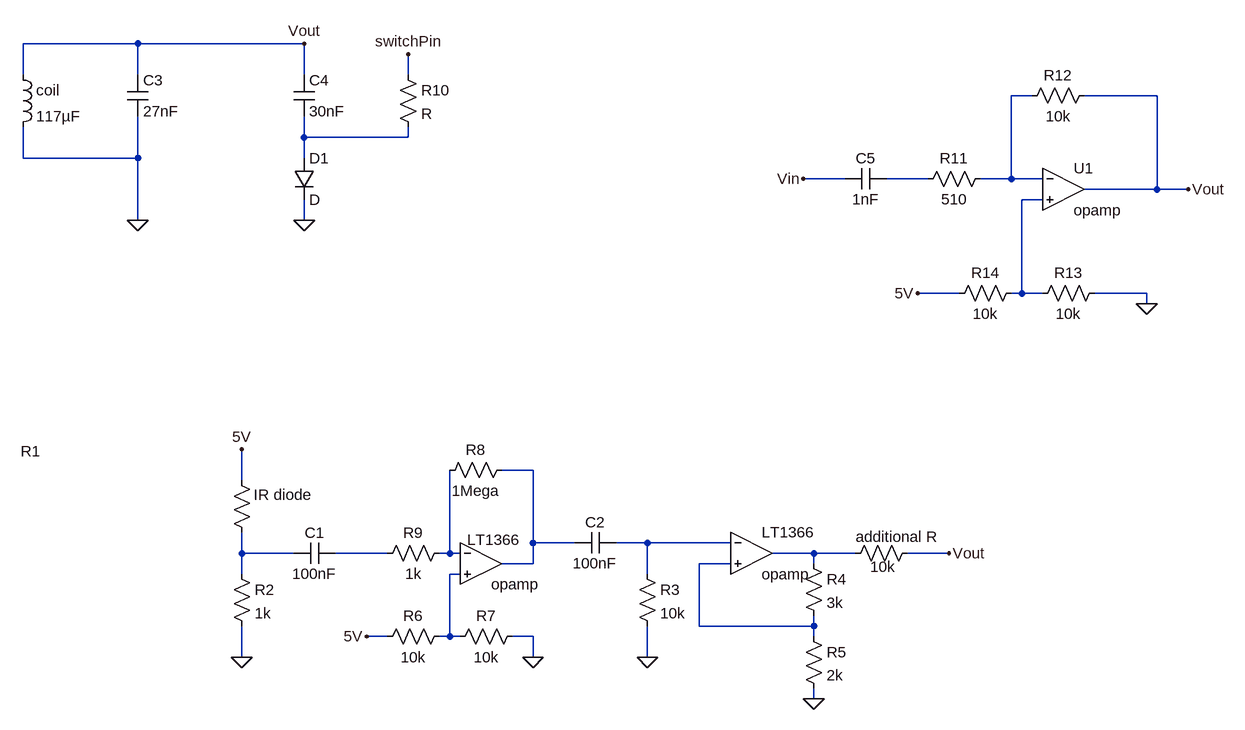
[diagram p0: schematic IR sensor circuit.asc]
IR sensor circuit.asc, the LTspice schematic file:
Version 4
SHEET 1 1496 680
WIRE -192 -624 -368 -624
WIRE 64 -624 -192 -624
WIRE -368 -576 -368 -624
WIRE -192 -576 -192 -624
WIRE 64 -576 64 -624
WIRE 224 -576 224 -608
WIRE 1184 -544 1152 -544
WIRE 1376 -544 1264 -544
WIRE 64 -480 64 -512
WIRE 224 -480 224 -496
WIRE 224 -480 64 -480
WIRE -368 -448 -368 -496
WIRE -192 -448 -192 -512
WIRE -192 -448 -368 -448
WIRE 64 -448 64 -480
WIRE 896 -416 832 -416
WIRE 1024 -416 960 -416
WIRE 1152 -416 1152 -544
WIRE 1152 -416 1104 -416
WIRE 1200 -416 1152 -416
WIRE 1376 -400 1376 -544
WIRE 1376 -400 1264 -400
WIRE 1424 -400 1376 -400
WIRE 1200 -384 1168 -384
WIRE -192 -352 -192 -448
WIRE 64 -352 64 -384
WIRE 1072 -240 1008 -240
WIRE 1168 -240 1168 -384
WIRE 1168 -240 1152 -240
WIRE 1200 -240 1168 -240
WIRE 1360 -240 1280 -240
WIRE 1360 -224 1360 -240
WIRE 416 32 368 32
WIRE -32 48 -32 0
WIRE 416 144 416 32
WIRE 480 144 416 144
WIRE 592 144 544 144
WIRE 720 144 592 144
WIRE -32 160 -32 128
WIRE 48 160 -32 160
WIRE 192 160 112 160
WIRE 288 160 288 32
WIRE 288 160 272 160
WIRE 304 160 288 160
WIRE 848 160 784 160
WIRE 912 160 848 160
WIRE 1056 160 992 160
WIRE 416 176 416 144
WIRE 416 176 368 176
WIRE 720 176 672 176
WIRE 848 176 848 160
WIRE -32 192 -32 160
WIRE 304 192 288 192
WIRE 592 192 592 144
WIRE 672 272 672 176
WIRE 848 272 848 256
WIRE 848 272 672 272
WIRE 192 288 160 288
WIRE 288 288 288 192
WIRE 288 288 272 288
WIRE 304 288 288 288
WIRE 416 288 384 288
WIRE 848 288 848 272
WIRE -32 320 -32 272
WIRE 416 320 416 288
WIRE 592 320 592 272
WIRE 848 384 848 368
FLAG -32 0 5V
FLAG 160 288 5V
FLAG -32 320 0
FLAG 416 320 0
FLAG 592 320 0
FLAG 848 384 0
FLAG 1056 160 Vout
FLAG -192 -352 0
FLAG 64 -352 0
FLAG 224 -608 switchPin
FLAG 64 -624 Vout
FLAG 1360 -224 0
FLAG 832 -416 Vin
FLAG 1424 -400 Vout
FLAG 1008 -240 5V
SYMBOL res -48 32 R0
WINDOW 0 -324 -29 Left 2
WINDOW 3 34 38 Left 2
SYMATTR InstName R1
SYMATTR Value IR diode
SYMBOL res -48 176 R0
SYMATTR InstName R2
SYMATTR Value 1k
SYMBOL cap 544 128 R90
WINDOW 0 0 32 VBottom 2
WINDOW 3 32 32 VTop 2
SYMATTR InstName C2
SYMATTR Value 100nF
SYMBOL res 576 176 R0
SYMATTR InstName R3
SYMATTR Value 10k
SYMBOL res 832 160 R0
SYMATTR InstName R4
SYMATTR Value 3k
SYMBOL res 832 272 R0
SYMATTR InstName R5
SYMATTR Value 2k
SYMBOL res 288 272 R90
WINDOW 0 0 56 VBottom 2
WINDOW 3 32 56 VTop 2
SYMATTR InstName R6
SYMATTR Value 10k
SYMBOL res 400 272 R90
WINDOW 0 0 56 VBottom 2
WINDOW 3 32 56 VTop 2
SYMATTR InstName R7
SYMATTR Value 10k
SYMBOL res 384 16 R90
WINDOW 0 0 56 VBottom 2
WINDOW 3 32 56 VTop 2
SYMATTR InstName R8
SYMATTR Value 1Mega
SYMBOL OpAmps\\opamp 336 112 R0
WINDOW 0 -21 27 Left 2
SYMATTR InstName LT1366
SYMBOL OpAmps\\opamp 752 96 R0
SYMATTR InstName LT1366
SYMBOL res 288 144 R90
WINDOW 0 0 56 VBottom 2
WINDOW 3 32 56 VTop 2
SYMATTR InstName R9
SYMATTR Value 1k
SYMBOL cap 112 144 R90
WINDOW 0 0 32 VBottom 2
WINDOW 3 32 32 VTop 2
SYMATTR InstName C1
SYMATTR Value 100nF
SYMBOL res 1008 144 R90
WINDOW 0 52 54 VBottom 2
WINDOW 3 -25 32 VTop 2
SYMATTR InstName 10k
SYMATTR Value additional R
SYMBOL ind -384 -592 R0
SYMATTR InstName coil
SYMATTR Value 117µF
SYMBOL cap -208 -576 R0
SYMATTR InstName C3
SYMATTR Value 27nF
SYMBOL cap 48 -576 R0
SYMATTR InstName C4
SYMATTR Value 30nF
SYMBOL OpAmps\\opamp 1232 -464 R0
SYMATTR InstName U1
SYMBOL res 1120 -432 R90
WINDOW 0 0 56 VBottom 2
WINDOW 3 32 56 VTop 2
SYMATTR InstName R11
SYMATTR Value 510
SYMBOL res 1280 -560 R90
WINDOW 0 0 56 VBottom 2
WINDOW 3 32 56 VTop 2
SYMATTR InstName R12
SYMATTR Value 10k
SYMBOL res 1296 -256 R90
WINDOW 0 0 56 VBottom 2
WINDOW 3 32 56 VTop 2
SYMATTR InstName R13
SYMATTR Value 10k
SYMBOL res 1168 -256 R90
WINDOW 0 0 56 VBottom 2
WINDOW 3 32 56 VTop 2
SYMATTR InstName R14
SYMATTR Value 10k
SYMBOL cap 960 -432 R90
WINDOW 0 0 32 VBottom 2
WINDOW 3 32 32 VTop 2
SYMATTR InstName C5
SYMATTR Value 1nF
SYMBOL diode 48 -448 R0
SYMATTR InstName D1
SYMBOL res 208 -592 R0
SYMATTR InstName R10

The netlist it stands for:
* IR sensor circuit.asc
R1 5V N007 IR diode
R2 N007 0 1k
C2 N006 N005 100nF
R3 N006 0 10k
R4 N010 N011 3k
R5 N011 0 2k
R6 N012 5V 10k
R7 0 N012 10k
R8 N005 N009 1Mega
XLT1366 N009 N012 N005 opamp Aol=100K GBW=10Meg  ; pins invin noninvin out
XLT1366 N006 N011 N010 opamp Aol=100K GBW=10Meg  ; pins invin noninvin out
R9 N009 N008 1k
C1 N008 N007 100nF
R§10k Vout N010 additional R
L§coil Vout 0 117µF
C3 Vout 0 27nF
C4 Vout N002 30nF
XU1 N001 N004 Vout opamp Aol=100K GBW=10Meg  ; pins invin noninvin out
R11 N001 N003 510
R12 Vout N001 10k
R13 0 N004 10k
R14 N004 5V 10k
C5 N003 Vin 1nF
D1 N002 0 D
R10 switchPin N002 R
.model D D
.lib standard.dio
.backanno
.end